# EAGLE schematic power_manager_ports (EAGLE 9.2.0)
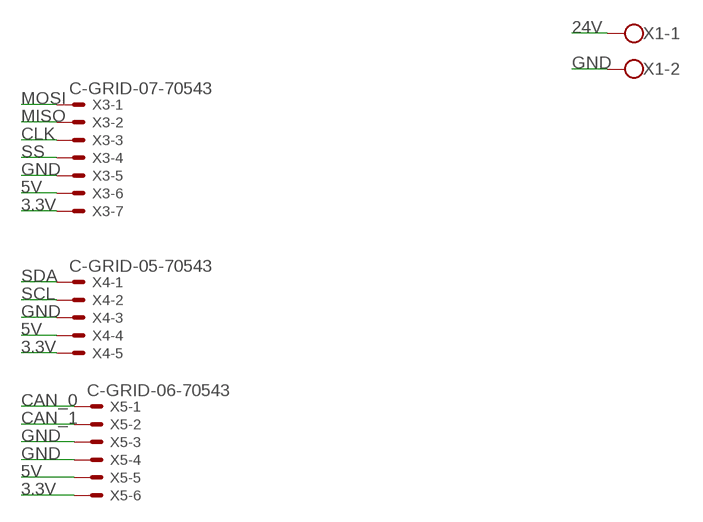
[diagram p0: schematic, sheet 1]

## Parts
X1  W239-302  [W239-302]
X3  C-GRID-07-70543  [70543-07]
X4  C-GRID-05-70543  [70543-05]
X5  C-GRID-06-70543  [70543-06]

## Nets
3.3V: X3.7 X4.5 X5.6
5V: X3.6 X4.4 X5.5
24V: X1.1
CAN_0: X5.1
CAN_1: X5.2
CLK: X3.3
GND: X1.2 X3.5 X4.3 X5.3 X5.4
MISO: X3.2
MOSI: X3.1
SCL: X4.2
SDA: X4.1
SS: X3.4

## Library data of the parts
X1 = con-wago-500:W239-302: WAGO SCREW CLAMP; OC_FARNELL: unknown; OC_NEWARK: unknown
X3 = con-molex:C-GRID-07: CONNECTOR wire to board 2.54 mm (0.100") pitch header; MF: MOLEX; OC_FARNELL: unknown; OC_NEWARK: unknown
X4 = con-molex:C-GRID-05: CONNECTOR wire to board 2.54 mm (0.100") pitch header; MF: MOLEX; OC_FARNELL: unknown; OC_NEWARK: unknown
X5 = con-molex:C-GRID-06: CONNECTOR wire to board 2.54 mm (0.100") pitch header; MF: MOLEX; OC_FARNELL: unknown; OC_NEWARK: unknown

## Net classes
0 default: clearance 0.205 mm